# Altium schematic sheet PSoC6 Cardiac Arrest Schematic.SchDoc
size 457 x 266 mm; SheetNumber: 1; SheetTotal: 1
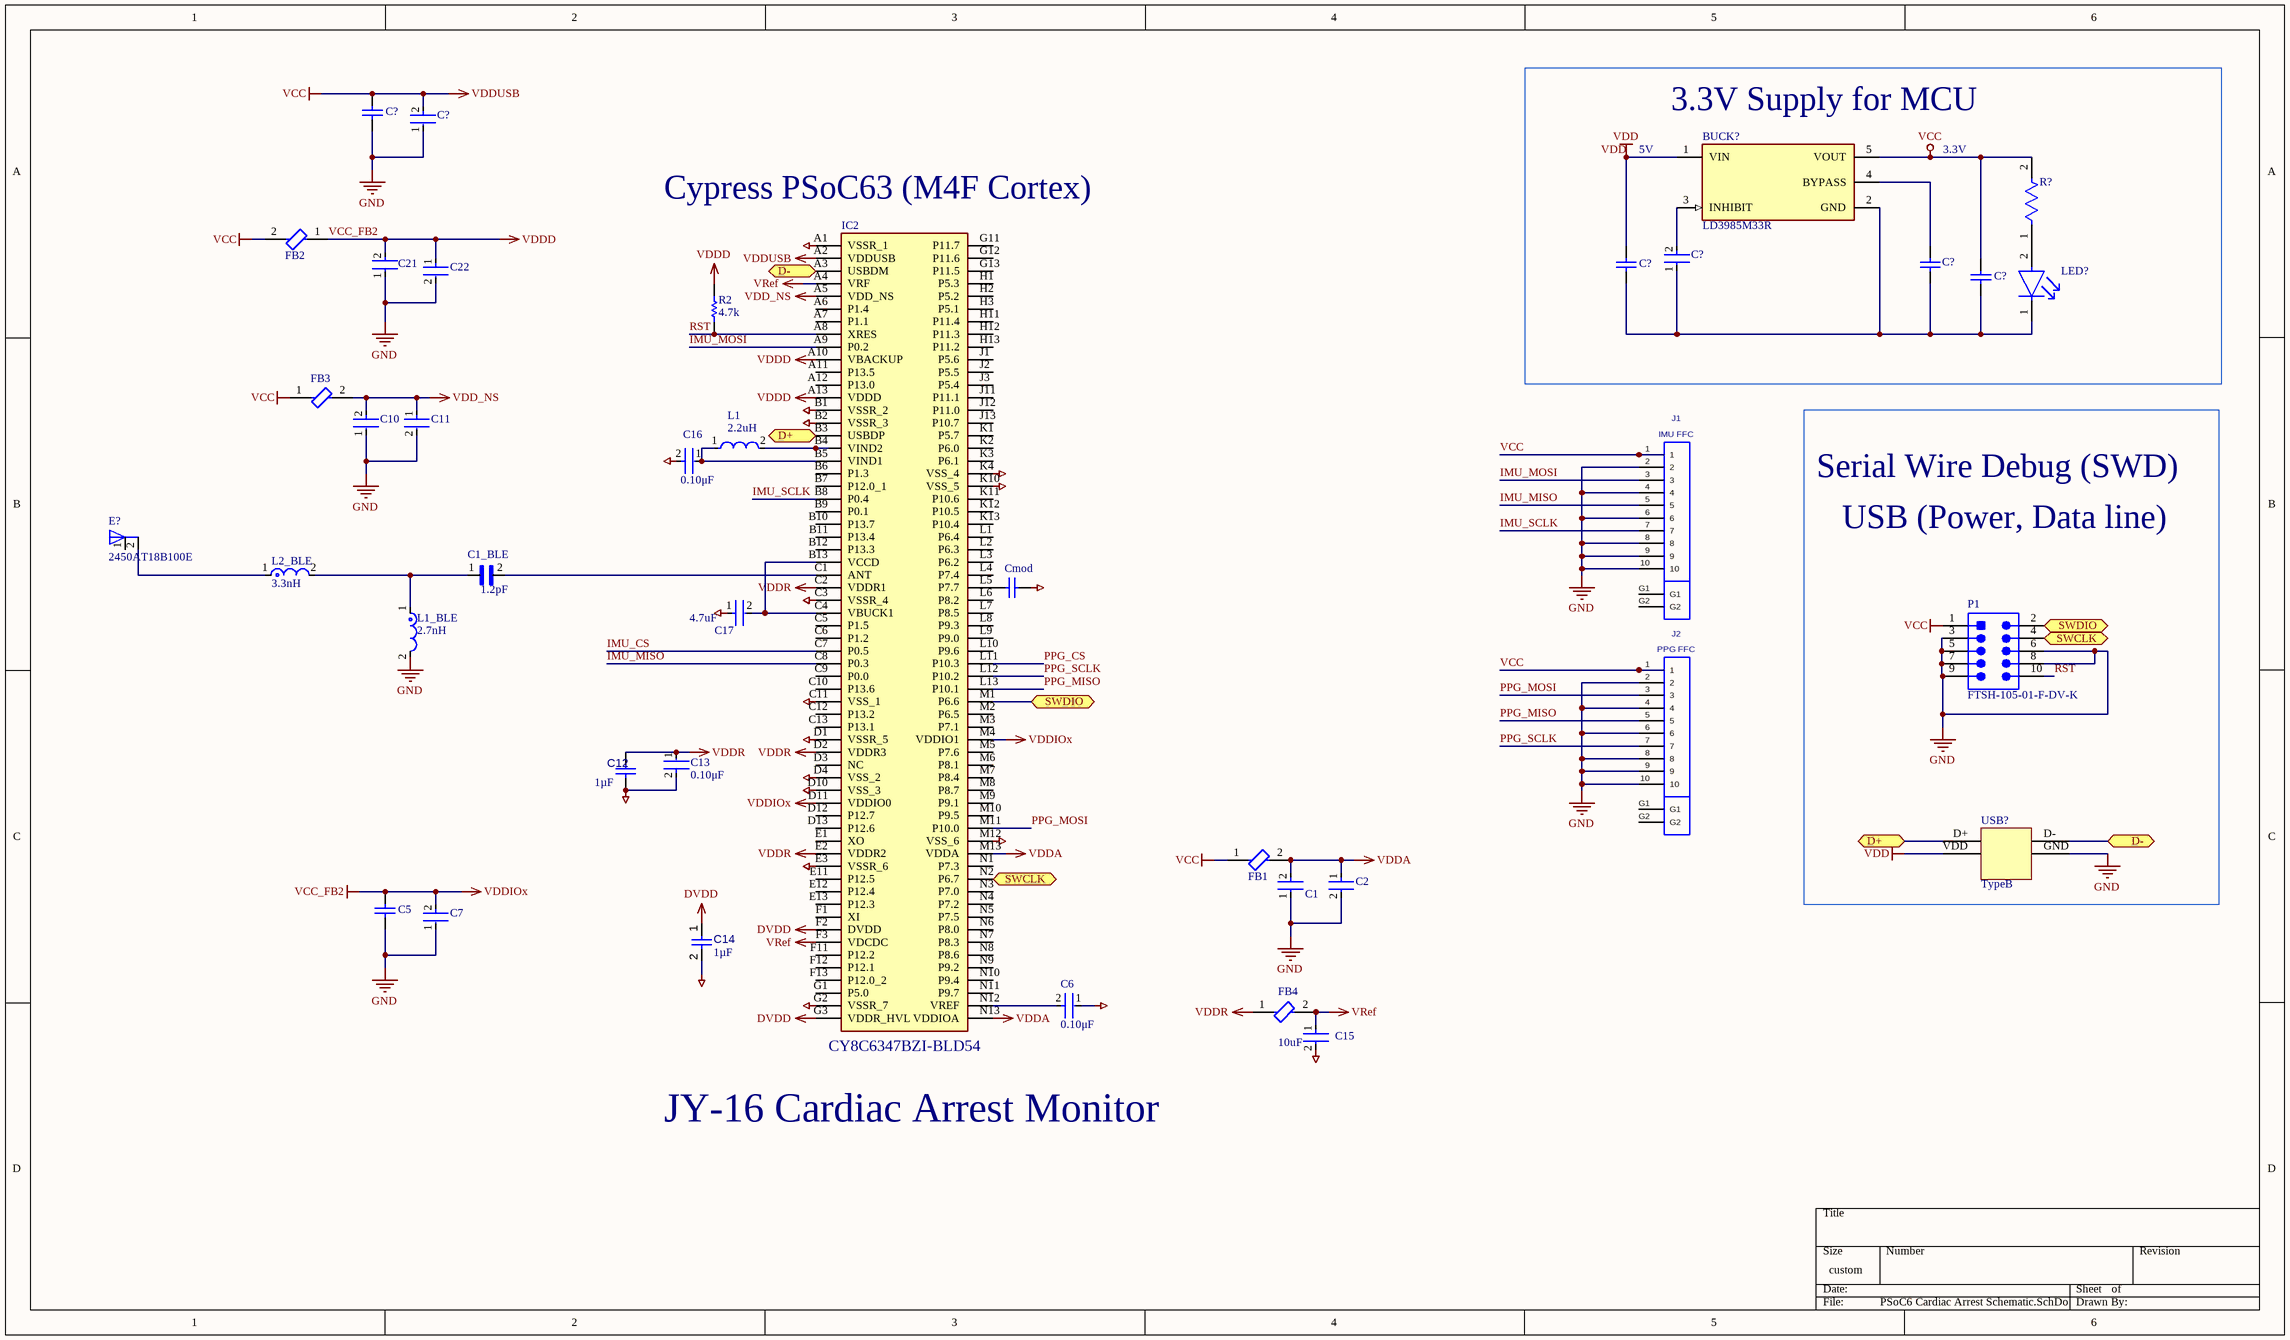
[diagram p0: PSoC6 Cardiac Arrest Schematic.SchDoc]

## Parts
(Parts that share a designator on the sheet are numbered #1, #2 ... from top to bottom, then left to right.)
BUCK?  LD3985M33R  [FP-SOT23-5L-7049676-MFG]
C1  GRM155R71C104KA88D  [FP-GRM15-MFG]  (value not drawn)
C1_BLE  1.2pF  [FIL_2450FM07A0029T]
C2  (no value)  [FP-C0805C-DG-MFG]
C5  C0805C105K4PACTU  [CAPC2013X145X50LL20T25]  (value not drawn)
C6  Capacitance: 0.10μF  [FP-GRM15-MFG]  (hidden comment: GRM155R71C104KA88D)
C7  GRM155R71C104KA88D  [FP-GRM15-MFG]  (value not drawn)
C10  GRM155R71C104KA88D  [FP-GRM15-MFG]  (value not drawn)
C11  C0805C106K8PACTU  [FP-C0805C-DG-MFG]  (value not drawn)
C12  value 1µF  [CAPC1005X55X25LL05T10]  (hidden comment: Capacitor 1 uF +/- 10% 6.3 V 0402)
C13  Capacitance: 0.10μF  [FP-GRM15-MFG]  (hidden comment: GRM155R71C104KA88D)
C14  value 1µF  [CAPC1005X55X25LL05T10]  (hidden comment: Capacitor 1 uF +/- 10% 6.3 V 0402)
C15  Capacitance: 10uF  [FP-GRM188-0_1-e0_2_0_55-IPC_A]  (hidden comment: GRM188R60J106ME47D)
C16  Capacitance: 0.10μF  [FP-GRM15-MFG]  (hidden comment: GRM155R71C104KA88D)
C17  Capacitance: 4.7uF  [FP-GRM155-0_1-IPC_B]  (hidden comment: GRM155R60J475ME47D)
C21  (no value)  [FP-GRM15-MFG]
C22  (no value)  [FP-C0805C-DG-MFG]
C?#1  GRM155R71C104KA88D  [FP-GRM15-MFG]  (value not drawn)
C?#2  C0805C105K4PACTU  [CAPC2013X145X50LL20T25]  (value not drawn)
C?#3  GRM155R71C104KA88D  [FP-GRM15-MFG]  (value not drawn)
C?#4  C0805C105K4PACTU  [CAPC2013X145X50LL20T25]  (value not drawn)
C?#5  08052C103KAT2A  [CAPC2013X140X50NL20T25]  (value not drawn)
C?#6  C0805C105K4PACTU  [CAPC2013X145X50LL20T25]  (value not drawn)
Cmod  GRM188R71H222KA01D  [CAPC1608X90X35NL10T15]  (value not drawn)
E?  2450AT18B100E  [XDCR_2450AT18B100E]
FB1  BLM18HE102SN1D  [FP-BLM18-0_15-t0_8-MFG]  (value not drawn)
FB2  BLM18HE102SN1D  [FP-BLM18-0_15-t0_8-MFG]  (value not drawn)
FB3  BLM18HE102SN1D  [FP-BLM18-0_15-t0_8-MFG]  (value not drawn)
FB4  BLM18HE102SN1D  [FP-BLM18-0_15-t0_8-MFG]  (value not drawn)
IC2  CY8C6347BZI-BLD54  [BGAS124C65P13X13_900X900X100]
J1  IMU FFC  [ZF5S-10-01-X-WT]
J2  PPG FFC  [ZF5S-10-01-X-WT]
L1  2.2uH  [FP-LQM21PH_G0-IPC_C]
L1_BLE  2.7nH  [FP-LQP03TG_02-IPC_A]
L2_BLE  3.3nH  [FP-LQP03TG_02-MFG]
LED?  LTST-C190GKT  [FP-LTST-C190GKT-MFG]  (value not drawn)
P1  FTSH-105-01-F-DV-K  [SMTC-FTSH-105-01-L-DV-K_V]
R2  4.7k  [RESC1005X40X25LL05T05]
R?  CRCW08052K00FKEA  [FP-CRCW0805-e3-IPC_B]  (value not drawn)
USB?  TypeB  [PCBComponent_1]

## Blocks framed on the sheet
3.3V Supply for MCU: BUCK? C?#3-C?#6 LED? R?

## Ports
D+ (bidir), D- (bidir), SWCLK (bidir), SWDIO (bidir)

## Nets
DVDD: C14.1 IC2.F2(DVDD) IC2.G3(VDDR_HVL)
GND: C1.1 C2.2 C5.1 C6.1 C7.1 C10.1 C11.2 C12.2 C13.2 C14.2 C15.2 C16.2 C17.1 C21.1 C22.2 C?#1.1 C?#2.1 Cmod.2 IC2.A1(VSSR_1) IC2.B1(VSSR_2) IC2.B2(VSSR_3) IC2.C3(VSSR_4) IC2.C11(VSS_1) IC2.D1(VSSR_5) IC2.D4(VSS_2) IC2.D10(VSS_3) IC2.E3(VSSR_6) IC2.G2(VSSR_7) IC2.K4(VSS_4) IC2.K10(VSS_5) IC2.M12(VSS_6) J1.2 J1.4 J1.6 J1.8 J1.9 J1.10 J2.2 J2.4 J2.6 J2.8 J2.9 J2.10 L1_BLE.2 P1.3 P1.5 P1.6 P1.7 P1.8 P1.9 USB?.GND
VCC: BUCK?.5(VOUT) C?#1.2 C?#2.2 C?#6.2 FB1.1 FB2.2 FB3.1 IC2.A2(VDDUSB) J1.1 J2.1 P1.1 R?.2  [also labelled VDDUSB]
VCC_FB2: C5.2 C7.2 C21.2 C22.1 FB2.1 IC2.A10(VBACKUP) IC2.A13(VDDD) IC2.D11(VDDIO0) IC2.M4(VDDIO1) R2.2  [also labelled VDDD, VDDIOx]
VDD: BUCK?.1(VIN) C?#4.2 USB?.VDD
VDD_NS: C10.2 C11.1 FB3.2 IC2.A5(VDD_NS)
VDDA: C1.2 C2.1 FB1.2 IC2.M13(VDDA) IC2.N13(VDDIOA)
VDDR: C12.1 C13.1 FB4.1 IC2.C2(VDDR1) IC2.D2(VDDR3) IC2.E2(VDDR2)
VRef: C15.1 FB4.2 IC2.A4(VRF) IC2.F3(VDCDC)
D+: IC2.B3(USBDP) USB?.D+ ; port D+
D-: IC2.A3(USBDM) USB?.D- ; port D-
IMU_CS: IC2.C7(P0.5)
IMU_MISO: IC2.C8(P0.3) J1.5
IMU_MOSI: IC2.A9(P0.2) J1.3
IMU_SCLK: IC2.B8(P0.4) J1.7
PPG_CS: IC2.L11(P10.3)
PPG_MISO: IC2.L13(P10.1) J2.5
PPG_MOSI: IC2.M11(P10.0) J2.3
PPG_SCLK: IC2.L12(P10.2) J2.7
RST: IC2.A8(XRES) P1.10 R2.1
SWCLK: IC2.N2(P6.7) P1.4 ; port SWCLK
SWDIO: IC2.M1(P6.6) P1.2 ; port SWDIO
NetBUCK?_2: BUCK?.2(GND) C?#3.1 C?#4.1 C?#5.1 C?#6.1 LED?.1(C)
NetBUCK?_3: BUCK?.3(INHIBIT) C?#3.2
NetBUCK?_4: BUCK?.4(BYPASS) C?#5.2
NetC1_BLE_1: C1_BLE.1 L1_BLE.1 L2_BLE.2
NetC1_BLE_2: C1_BLE.2 IC2.C1(ANT)
NetC6_2: C6.2 IC2.N12(VREF)
NetC16_1: C16.1 IC2.B5(VIND1) L1.1
NetC17_2: C17.2 IC2.B13(VCCD) IC2.C4(VBUCK1)
NetCmod_1: Cmod.1 IC2.L5(P7.7)
NetE?_2: E?.2(NC) L2_BLE.1
NetIC2_B4: IC2.B4(VIND2) L1.2
NetLED?_2: LED?.2(A) R?.1

Not connected (* = marked no-connect by the designer): E? 1(FEED); IC2 A6(P1.4) A7(P1.1) A11(P13.5) A12(P13.0) B6(P1.3) B7(P12.0_1) B9(P0.1) B10(P13.7) B11(P13.4) B12(P13.3) C5(P1.5) C6(P1.2) C9(P0.0) C10(P13.6) C12(P13.2) C13(P13.1) D3(NC) D12(P12.7) D13(P12.6) E1(XO) E11(P12.5) E12(P12.4) E13(P12.3) F1(XI) F11(P12.2) F12(P12.1) F13(P12.0_2) G1(P5.0) G11(P11.7) G12(P11.6) G13(P11.5) H1(P5.3) H2(P5.2) H3(P5.1) H11(P11.4) H12(P11.3) H13(P11.2) J1(P5.6) J2(P5.5) J3(P5.4) J11(P11.1) J12(P11.0) J13(P10.7) K1(P5.7) K2(P6.0) K3(P6.1) K11(P10.6) K12(P10.5) K13(P10.4) L1(P6.4) L2(P6.3) L3(P6.2) L4(P7.4) L6(P8.2) L7(P8.5) L8(P9.3) L9(P9.0) L10(P9.6) M2(P6.5) M3(P7.1) M5(P7.6) M6(P8.1) M7(P8.4) M8(P8.7) M9(P9.1) M10(P9.5) N1(P7.3) N3(P7.0) N4(P7.2) N5(P7.5) N6(P8.0) N7(P8.3) N8(P8.6) N9(P9.2) N10(P9.4) N11(P9.7); J1 G1 G2; J2 G1 G2

## Notes on the sheet
- 5V
- 3.3V
- (near IC2) Cypress PSoC63 (M4F Cortex)
- Serial Wire Debug (SWD)
- USB (Power, Data line)
- JY-16 Cardiac Arrest Monitor
- Labels drawn without touching a wire or pin: VDD

## Library data of the parts
BUCK? = CMP-0244-00328-2: IC REG LINEAR 3.3V 150MA SOT23-5; Input Bias Current: 85uA; Output Type: Fixed; Max Input Voltage: 6V; Min Input Voltage: 2.5V; Output Voltage Accuracy: 2%; Quiescent Current: 150uA; Number of Regulators: 1; Min Current Limit: 300mA; Dropout Voltage: 60mV; Polarity: Positive; Min Operating Temperature: -40°C; Height: 1.3mm; Radiation Hardening: No; Package Quantity: 1; Number of Pins: 5; Output Current: 150mA; Width: 1.75mm; Length: 3mm; Mount: Surface Mount; Case/Package: SOT-23; Lead Free: Lead Free; Number of Outputs: 1; Max Operating Temperature: 125°C; Accuracy: 2%; Max Output Current: 150mA; Packaging: Tape and Reel; Output Voltage: 3.3V; Min Output Voltage: 3.3V
C1 C7 C10 C?#1 C?#3 = CMP-2100-03641-2: CAP CER 0.1UF 16V X7R 0402; Manufacturer: Murata; Standoff Height: 0mm; Tolerance: 10%; Voltage Rating: 16Vdc; Material: Ceramic; Capacitance: 0.10μF; Value: 0.10μF; RoHS: TRUE; Manufacturer Part Number: GRM155R71C104KA88D; Temperature Characteristic: X7R; Octopart: https://octopart.com/grm155r71c104ka88d-murata-196880; Digikey Description: CAP CER 0.1UF 16V X7R 0402; Device Class L3: Ceramic Capacitors; Height: 0.55mm; ComponentLink2Description: Datasheet; Temperature Range Low: -55°C; Ipc Land Pattern Name: CAPC10050X219; ComponentLink2URL: https://search.murata.co.jp/Ceramy/image/img/A01X/G101/ENG/GRM155R71H471KA01-01A.pdf; Device Class L1: Passive Components; Lead Free: yes; Category: Cap; Package: GRM15; Temperature: -55°C to +125°C; Device Class L2: Capacitors; Temperature Range High: +125°C; Mouser Description: 0402 0.1 uF 16V ±10 % Tolerance X7R SMT Multilayer Ceramic Capacitor
C1_BLE = 500R07S1R2BV4T: 1.2 pF Â±0.1pF 50V Ceramic Capacitor C0G, NP0 0402 (1005 Metric); MF: Johanson Technology; MP: 500R07S1R2BV4T; Digi-Key_Part_Number: 712-1268-2-ND; Package: 0402 Johanson; Check_prices: https://www.snapeda.com/parts/500R07S1R2BV4T/Johanson+Technology+Inc./view-part/?ref=eda; Value: *; Purchase-URL: https://pricing.snapeda.com/search/part/500R07S1R2BV4T/?ref=eda; SnapEDA_Link: https://www.snapeda.com/parts/500R07S1R2BV4T/Johanson+Technology+Inc./view-part/?ref=snap
C2 C22 = CMP-2007-03243-2: CAP CER 10UF 10V X5R 0805; Manufacturer Part Number: C0805C106K8PACTU; Manufacturer: Kemet; 3DS Part Number: 220-00001; Tolerance: 10%; Temperature Coefficient: 15%; Material: Ceramic; Device Class L2: Capacitors; Device Class L1: Passive Components; ComponentLink2URL: https://content.kemet.com/datasheets/KEM_C1006_X5R_SMD.pdf; Height: 1.4mm; Lead Free: Yes; Digikey Description: CAP CER 10UF 10V X5R 0805; Octopart: https://octopart.com/c0805c106k8pactu-kemet-98697; Capacitance: 10uF; Value: 10uF; Temperature Range Low: -55°C; Temperature: -55°C to +85°C; Automotive: No; Mouser Description: CAP CER 10UF 10V X5R 0805; Ipc Land Pattern Name: CAPC200125X125; Temperature Range High: +85°C; Voltage: 10V; RoHS: TRUE; Device Class L3: Ceramic Capacitors; ComponentLink2Description: Datasheet; Voltage Rating: 10V; Package: C0805C-DG; Temperature Characteristic: X5R; Category: Cap
C5 C?#2 C?#4 C?#6 = CMP-1036-04746-2: Manufacturer: Kemet; Part Number: C0805C105K4PACTU
C6 C13 C16 = CMP-2100-03641-2: CAP CER 0.1UF 16V X7R 0402; Manufacturer: Murata; Standoff Height: 0mm; Tolerance: 10%; Voltage Rating: 16Vdc; Material: Ceramic; Value: 0.10μF; RoHS: TRUE; Manufacturer Part Number: GRM155R71C104KA88D; Temperature Characteristic: X7R; Octopart: https://octopart.com/grm155r71c104ka88d-murata-196880; Digikey Description: CAP CER 0.1UF 16V X7R 0402; Device Class L3: Ceramic Capacitors; Height: 0.55mm; ComponentLink2Description: Datasheet; Temperature Range Low: -55°C; Ipc Land Pattern Name: CAPC10050X219; ComponentLink2URL: https://search.murata.co.jp/Ceramy/image/img/A01X/G101/ENG/GRM155R71H471KA01-01A.pdf; Device Class L1: Passive Components; Lead Free: yes; Category: Cap; Package: GRM15; Temperature: -55°C to +125°C; Device Class L2: Capacitors; Temperature Range High: +125°C; Mouser Description: 0402 0.1 uF 16V ±10 % Tolerance X7R SMT Multilayer Ceramic Capacitor
C11 = CMP-2007-03243-2: CAP CER 10UF 10V X5R 0805; Manufacturer: Kemet; 3DS Part Number: 220-00001; Tolerance: 10%; Temperature Coefficient: 15%; Material: Ceramic; Device Class L2: Capacitors; Device Class L1: Passive Components; ComponentLink2URL: https://content.kemet.com/datasheets/KEM_C1006_X5R_SMD.pdf; Height: 1.4mm; Lead Free: Yes; Manufacturer Part Number: C0805C106K8PACTU; Digikey Description: CAP CER 10UF 10V X5R 0805; Octopart: https://octopart.com/c0805c106k8pactu-kemet-98697; Capacitance: 10uF; Value: 10uF; Temperature Range Low: -55°C; Temperature: -55°C to +85°C; Automotive: No; Mouser Description: CAP CER 10UF 10V X5R 0805; Ipc Land Pattern Name: CAPC200125X125; Temperature Range High: +85°C; Voltage: 10V; RoHS: TRUE; Device Class L3: Ceramic Capacitors; ComponentLink2Description: Datasheet; Voltage Rating: 10V; Package: C0805C-DG; Temperature Characteristic: X5R; Category: Cap
C12 C14 = CMP-001-00008-5: Chip Capacitor, 1 uF, +/- 10%, 6.3 V, 0402 (1005 Metric); Capacitor Type: Ceramic; Voltage Rating: 6.3V; Mounting Technology: SM; RoHS Compliant: True; Pins: 2; Case/Package: 0402; Max Operating Temperature: 85°C; Min Operating Temperature: -55°C; Tolerance: 10%
C15 = CMP-2006-02792-2: Chip Multilayer Ceramic Capacitors for General Purpose, 0603, 10uF, X5R, 15%, 20%, 6.3V; Packaging: Tape and Reel; Voltage Rating (DC): 6.3V; Width: 0.031inch; Termination: SMD/SMT; Dielectric: X5R; Package Quantity: 4000; Voltage Rating: 6.3V; Case/Package: 0603; Min Operating Temperature: -55°C; Voltage: 6.3V; Length: 1.6mm; Thickness: 0.035inch; Lead Free: Lead Free; Depth: 0.8mm; Case Code (Imperial): 0603; Max Operating Temperature: 85°C; Material: Ceramic; Height: 0.8mm; Tolerance: 20%; Mount: Surface Mount; REACH SVHC: No SVHC; Radiation Hardening: No; Case Code (Metric): 1608
C17 = CMP-2008-04549-2: Chip Multilayer Ceramic Capacitors for General Purpose, 0402, 4.7uF, X5R, 15%, 20%, 6.3V; Height: 0.5mm; Weight: 0.000212oz; Length: 1mm; Case Code (Metric): 1005; Packaging: Tape and Reel; Termination: SMD/SMT; Dielectric: X5R; Depth: 0.5mm; Case Code (Imperial): 0402; Min Operating Temperature: -55°C; Case/Package: 0402; Voltage: 6.3V; Width: 0.02inch; Lead Free: Lead Free; Thickness: 0.022inch; Contact Plating: Tin; REACH SVHC: No SVHC; Package Quantity: 10000; Tolerance: 20%; Voltage Rating (DC): 6.3V; Voltage Rating: 6.3V; Mount: Surface Mount; Max Operating Temperature: 85°C
C21 = CMP-2100-03641-2: CAP CER 0.1UF 16V X7R 0402; Manufacturer Part Number: GRM155R71C104KA88D; Manufacturer: Murata; Standoff Height: 0mm; Tolerance: 10%; Voltage Rating: 16Vdc; Material: Ceramic; Capacitance: 0.10μF; Value: 0.10μF; RoHS: TRUE; Temperature Characteristic: X7R; Octopart: https://octopart.com/grm155r71c104ka88d-murata-196880; Digikey Description: CAP CER 0.1UF 16V X7R 0402; Device Class L3: Ceramic Capacitors; Height: 0.55mm; ComponentLink2Description: Datasheet; Temperature Range Low: -55°C; Ipc Land Pattern Name: CAPC10050X219; ComponentLink2URL: https://search.murata.co.jp/Ceramy/image/img/A01X/G101/ENG/GRM155R71H471KA01-01A.pdf; Device Class L1: Passive Components; Lead Free: yes; Category: Cap; Package: GRM15; Temperature: -55°C to +125°C; Device Class L2: Capacitors; Temperature Range High: +125°C; Mouser Description: 0402 0.1 uF 16V ±10 % Tolerance X7R SMT Multilayer Ceramic Capacitor
C?#5 = CMP-2007-04596-1: Manufacturer: AVX Interconnect / Elco; Part Number: 08052C103KAT2A
Cmod = CMP-2006-02908-5: Chip Capacitor, 2.2 nF, +/- 10%, 50 V, -55 to 125 degC, 0603 (1608 Metric), RoHS, Tape and Reel; Manufacturer: Murata; Voltage Rating: 50 V; Pins: 2; Mount: Surface Mount; Max Operating Temperature: 125 degC; ComponentLink1Description: Manufacturer URL; RoHSCompliant: true; PackageDescription: 2-Pin Surface Mount Device, Body 1.6 x 0.8 mm; ComponentLink2URL: http://search.murata.co.jp/Ceramy/image/img/A01X/G101/ENG/GRM188R71H222KA01-01.pdf; PackageReference: 0603; Height: 0.8 mm; Lead Pitch: 4 mm; Packaging: Tape and Reel; DatasheetVersion: 02/2016; Mounting Technology: Surface Mount; ComponentLink2Description: Datasheet; Min Operating Temperature: -55 degC; Length: 1.6 mm; REACH SVHC: No SVHC; Package Quantity: 4000; ComponentLink1URL: http://www.murata.com/
E? = 2450AT18B100E: 2.4GHz - Chip RF Antenna 2.4GHz ~ 2.5GHz 0.5dBi Solder Surface Mount; MF: Johanson Technology; Price: None; Package: None; Purchase-URL: https://pricing.snapeda.com/search/part/2450AT18B100E/?ref=eda; MP: 2450AT18B100E; Availability: In Stock; SnapEDA_Link: https://www.snapeda.com/parts/2450AT18B100E/Johanson+Technology+Inc./view-part/?ref=snap; Check_prices: https://www.snapeda.com/parts/2450AT18B100E/Johanson+Technology+Inc./view-part/?ref=eda; Value: *
FB1-FB4 = CMP-0686-00363-3: Chip Ferrite Bead, 0603, 1000Ω @ 100MHz, 0.35Ω, 25%, 600mA; DC Resistance (DCR): 350mR; Impedance: 1kR; Number of Circuits: 1; Material: Steel; Packaging: Tape and Reel; Test Frequency: 100MHz; Max Operating Temperature: 125°C; Core Material: Ferrite; Width: 0.8mm; Height: 0.8mm; Case/Package: 0603; Termination: SMD/SMT; Length: 1.6mm; Radiation Hardening: No; REACH SVHC: No SVHC; Max DC Current: 600mA; Case Code (Imperial): 0603; Min Operating Temperature: -55°C; DC Current: 600mA; Current Rating: 600mA; Lead Free: Lead Free; Number of Lines: 1; Tolerance: 25%; Max Current Rating: 600mA; Case Code (Metric): 1608; Package Quantity: 1; Depth: 0.8mm; Military Standard: Not; Number of Pins: 2
IC2 = CY8C6347BZI-BLD54: Integrated Circuit; Manufacturer_Name: Cypress Semiconductor; Datasheet Link: https://www.arrow.com/en/products/cy8c6347bzi-bld54/cypress-semiconductor; Height: 1mm; Manufacturer_Part_Number: CY8C6347BZI-BLD54; Mouser Part Number: 727-CY8C6347BZIBLD54; Mouser Price/Stock: https://www.mouser.co.uk/ProductDetail/Cypress-Semiconductor/CY8C6347BZI-BLD54/?qs=XeJtXLiO41TbiRPpjrRqiA%3D%3D; Arrow Part Number: CY8C6347BZI-BLD54; Arrow Price/Stock: https://www.arrow.com/en/products/cy8c6347bzi-bld54/cypress-semiconductor
J1 J2 = ZF5S-10-01-X-WT: ZERO INSERTION FORCE 0.5MM ASSEMBLY, 01 LEAD STYLE.; MANUFACTURER: SAMTEC; CREATED: January 30, 2015 - Wendy Xin; PCB DECAL: ZF5S-10-01-X-WT
L1 = CMP-06042-016317-1: Multilayer Type Inductor for Power Lines, 0805 (2012), 2.2μH, 30%, 0.288Ω, 0.8A; Test Frequency: 1MHz; Shielding: Shielded; Current Rating: 800mA; Self Resonant Frequency: 40MHz; Core Material: Ferrite; DC Resistance (DCR): 288mR; RoHS Compliant: Yes; REACH SVHC: No SVHC; Inductance Tolerance: 30%; Package Quantity: 4000; Military Standard: Not; Max Operating Temperature: 125°C; Radiation Hardening: No; Series: LQM; Height - Seated (Max): 0.039inch; Tolerance: 30%; Height: 0.9mm; Lead Free: Lead Free; Case Code (Metric): 2012; Packaging: Tape and Reel; Termination: SMD/SMT; Case Code (Imperial): 0805; Min Operating Temperature: -55°C; Depth: 1.4mm; Mount: Surface Mount; Length: 2mm; Inductance: 2.2uH; DC Current: 800mA; Case/Package: 0805; Max DC Current: 800mA; Width: 0.049inch
L1_BLE = CMP-06042-013213-1: Film type RF Inductor 2.7nH ±0.1nH 500mA 0.2Ω 0201 (0603); Core Material: Non-Magnetic; Tolerance: 3%; Self Resonant Frequency: 6GHz; Current: 350mA; Test Frequency: 500MHz; Q Factor: 14; DC Resistance (DCR): 200mR; Shielding: Unshielded; DC Current: 500mA; Resistor Type: Thin Film; Case/Package: 0201; Max DC Current: 500mA; Length: 0.024inch; Case Code (Imperial): 0201; Min Operating Temperature: -55°C; Width: 0.3mm; Termination: SMD/SMT; Inductance: 2.7nH; REACH SVHC: No SVHC; Max Operating Temperature: 125°C; Height: 0.3mm; Height - Seated (Max): 0.013inch; Military Standard: Not; Packaging: Tape and Reel; Radiation Hardening: No; Lead Free: Lead Free; Package Quantity: 15000; Case Code (Metric): 0603; Current Rating: 500mA; Mount: Surface Mount; Depth: 0.33mm
L2_BLE = CMP-06042-014154-1: Film type RF Inductor 3.3nH ±0.1nH 450mA 0.25Ω 0201 (0603); Tolerance: 3%; DC Resistance (DCR): 250mR; Shielding: Unshielded; Q Factor: 14; Current: 300mA; Self Resonant Frequency: 8GHz; Test Frequency: 500MHz; Core Material: Non-Magnetic; Mount: Surface Mount; Radiation Hardening: No; Width: 0.012inch; Case Code (Imperial): 0201; Current Rating: 450mA; Height: 0.012inch; Height - Seated (Max): 0.013inch; Package Quantity: 15000; Termination: SMD/SMT; Inductance: 3.3nH; Max Operating Temperature: 125°C; DC Current: 450mA; Min Operating Temperature: -55°C; Max DC Current: 450mA; Packaging: Tape and Reel; Resistor Type: Thin Film; Case/Package: 0201; Case Code (Metric): 0603; Lead Free: Lead Free; Depth: 0.33mm; Length: 0.024inch; Military Standard: Not
LED? = CMP-22017-000005-2: LED GREEN CLEAR CHIP SMD; Dominant Wavelength: 569nm; Reverse Voltage: 5V; Lens Color: Colorless; Viewing Angle: 130°; Voltage: 2V; Forward Current: 30mA; Power Dissipation: 100mW; Luminous Intensity: 6mcd; Number of LEDs: 1; Forward Voltage: 2.1V; Wavelength: 565nm; Test Current: 10mA; Min Operating Temperature: -55°C; Lens Style: Clear; Mount: Surface Mount; Width: 0.8mm; Packaging: Tape and Reel; Lens Transparency: Clear; Case Code (Metric): 1608; Depth: 0.8mm; Case Code (Imperial): 0603; Case/Package: 0603; Number of Pins: 2; Max Operating Temperature: 85°C; Lead Free: Lead Free; Number of Elements: 1; Length: 1.6mm; Height: 0.8mm; Package Quantity: 1; Power Rating: 100mW; Radiation Hardening: No; Illumination Color: Green; Color: Green
P1 = CMP-2000-05352-1: Male Header, Pitch 1.27 mm, 2 x 5 Position, Height 6.12 mm, RoHS, Tube; Manufacturer: Samtec; Number of Positions: 10; Connector Type: Header,Shrouded; Number of Positions Loaded: All; Row Spacing: 0.050"(1.27mm); Fastening Type: -; Package Reference: FTSH-105-01-L-DV-K; Termination: Solder; Package URL: http://suddendocs.samtec.com/prints/ftsh-1xx-xx-xxx-dv-xxx-footprint.pdf; Number of Rows: 2; Contact Finish Thickness: 3µin(0.08µm); Contact Type: MalePin; Manufacturer URL: http://www.samtec.com/; Contact Mating Length: 0.120"(3.05mm); Pitch: 0.050"(1.27mm); Series: FTSH; Features: -; Contact Finish: Gold; Color: Black; Family: RectangularConnectors-Headers,MalePins; Datasheet URL: http://suddendocs.samtec.com/prints/ftsh-1xx-xx-xxx-dv-xxx-mkt.pdf; Package Description: Male Header, Pitch 1.27 mm, 2 x 5 Position, Height 5.97 mm, Tail Length 4.32 mm; Mounting Type: SurfaceMount; Datasheet Version: Rev. ET, 10/1995; Category: Connectors,Interconnects; Packaging: Tube
R2 = CMP-2002-01154-4: Chip Resistor, 4.7 KOhm, +/- 1%, 0.1 W, -55 to 155 degC, 0402 (1005 Metric), RoHS, Tape and Reel; PartNumber: ERJ-2RKF4701X; Voltage Rating: 50 V; Case\/Package: 0402; Power Rating: 100 mW; Height: 0.35 mm; Mounting Technology: Surface Mount; REACH SVHC: Yes; Resistance: 4.7 KOhm; Max Operating Temperature: 155 degC; ComponentLink1Description: Manufacturer URL; ComponentLink2Description: Datasheet; Pins: 2; PackageReference: 0402; Tolerance: 1%; Case Code (Imperial): 0402; Length: 1 mm; PackageDescription: 2-Pin Surface Mount Device, Body 1 x 0.5 mm; RoHSCompliant: true; Package Quantity: 1; Radiation Hardening: No; DatasheetVersion: 04/2015; Width: 0.5 mm; Case Code (Metric): 1005; Mount: Surface Mount; ComponentLink1URL: http://www.panasonic.com/; Min Operating Temperature: -55 degC; Packaging: Cut Tape; ComponentLink2URL: http://industrial.panasonic.com/cdbs/www-data/pdf/RDA0000/AOA0000C86.pdf
R? = CMP-2001-03755-2: RES Thick Film, 2kΩ, 1%, 0.125W, 100ppm/°C, 0805; Working Voltage: 150V; Max Power Dissipation: 125mW; Resistance: 2kR; Package Quantity: 10; Case Code (Metric): 2012; Voltage Rating: 150V; Number of Terminations: 2; Max Operating Temperature: 155°C; Depth: 1.25mm; Tolerance: 1%; Power Rating: 125mW; Lead Free: Lead Free; Case/Package: 0805; Features: Automotive AEC-Q200; Min Operating Temperature: -55°C; Termination: SMD/SMT; Case Code (Imperial): 0805; Weight: 0.000194oz; Packaging: Tape and Reel; Military Standard: Not; Radiation Hardening: No; Contact Plating: Tin; Mount: Surface Mount; Temperature Coefficient: 100ppm/°C; Height: 0.02inch; Number of Terminals: 2; Voltage Rating (DC): 150V; Number of Pins: 2; Length: 2mm; Width: 1.25mm; Composition: Thick Film
USB? = USB Receptacle: USB receptacle schematic footprint